# Altium schematic sheet PLD_HK.SchDoc: RadFET
size A4; SheetTotal: 32
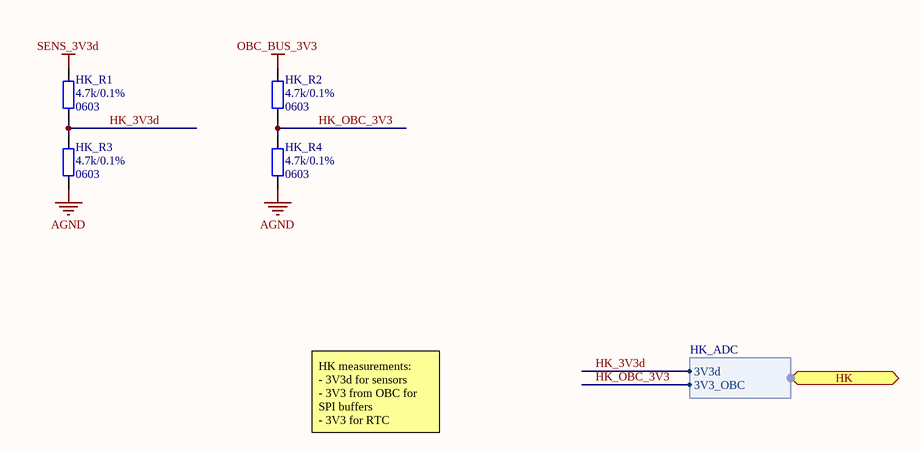
[diagram p0: PLD_HK.SchDoc]

## Parts
HK_R1  Package: 0603  [SMD_Resistor_0603]  (hidden comment: 4.7k/0.1%)
HK_R2  Package: 0603  [SMD_Resistor_0603]  (hidden comment: 4.7k/0.1%)
HK_R3  Package: 0603  [SMD_Resistor_0603]  (hidden comment: 4.7k/0.1%)
HK_R4  Package: 0603  [SMD_Resistor_0603]  (hidden comment: 4.7k/0.1%)

## Ports
HK (harness HK_ADC)

## Harnesses
HK_ADC: 3V3_OBC, 3V3d

## Nets
AGND: HK_R3.2 HK_R4.2
OBC_BUS_3V3: HK_R2.1
SENS_3V3d: HK_R1.1
HK_3V3d: HK_R1.2 HK_R3.1 ; port HK.3V3d
HK_OBC_3V3: HK_R2.2 HK_R4.1 ; port HK.3V3_OBC

## Notes on the sheet
- HK measurements:
  - 3V3d for sensors
  - 3V3 from OBC for SPI buffers
  - 3V3 for RTC
- Title:
- Project:
- Author:
- Model:
- Document Number:
- Checked by:
- Rev:
- Date:
- Approved by:
- Sheet:
- of
- File name:

## Library data of the parts
HK_R1-HK_R4 = Res: Value: 4.7k/0.1%